# EasyEDA schematic SCH_5G23-dev1_2022-10-18.json

## Sheets
1 5G23: TITLE: 5G23; REV: 1.0; Date: 2022-04-18; Sheet: 1/1; Drawn By: BH2VGM; Company: NEU-ISE
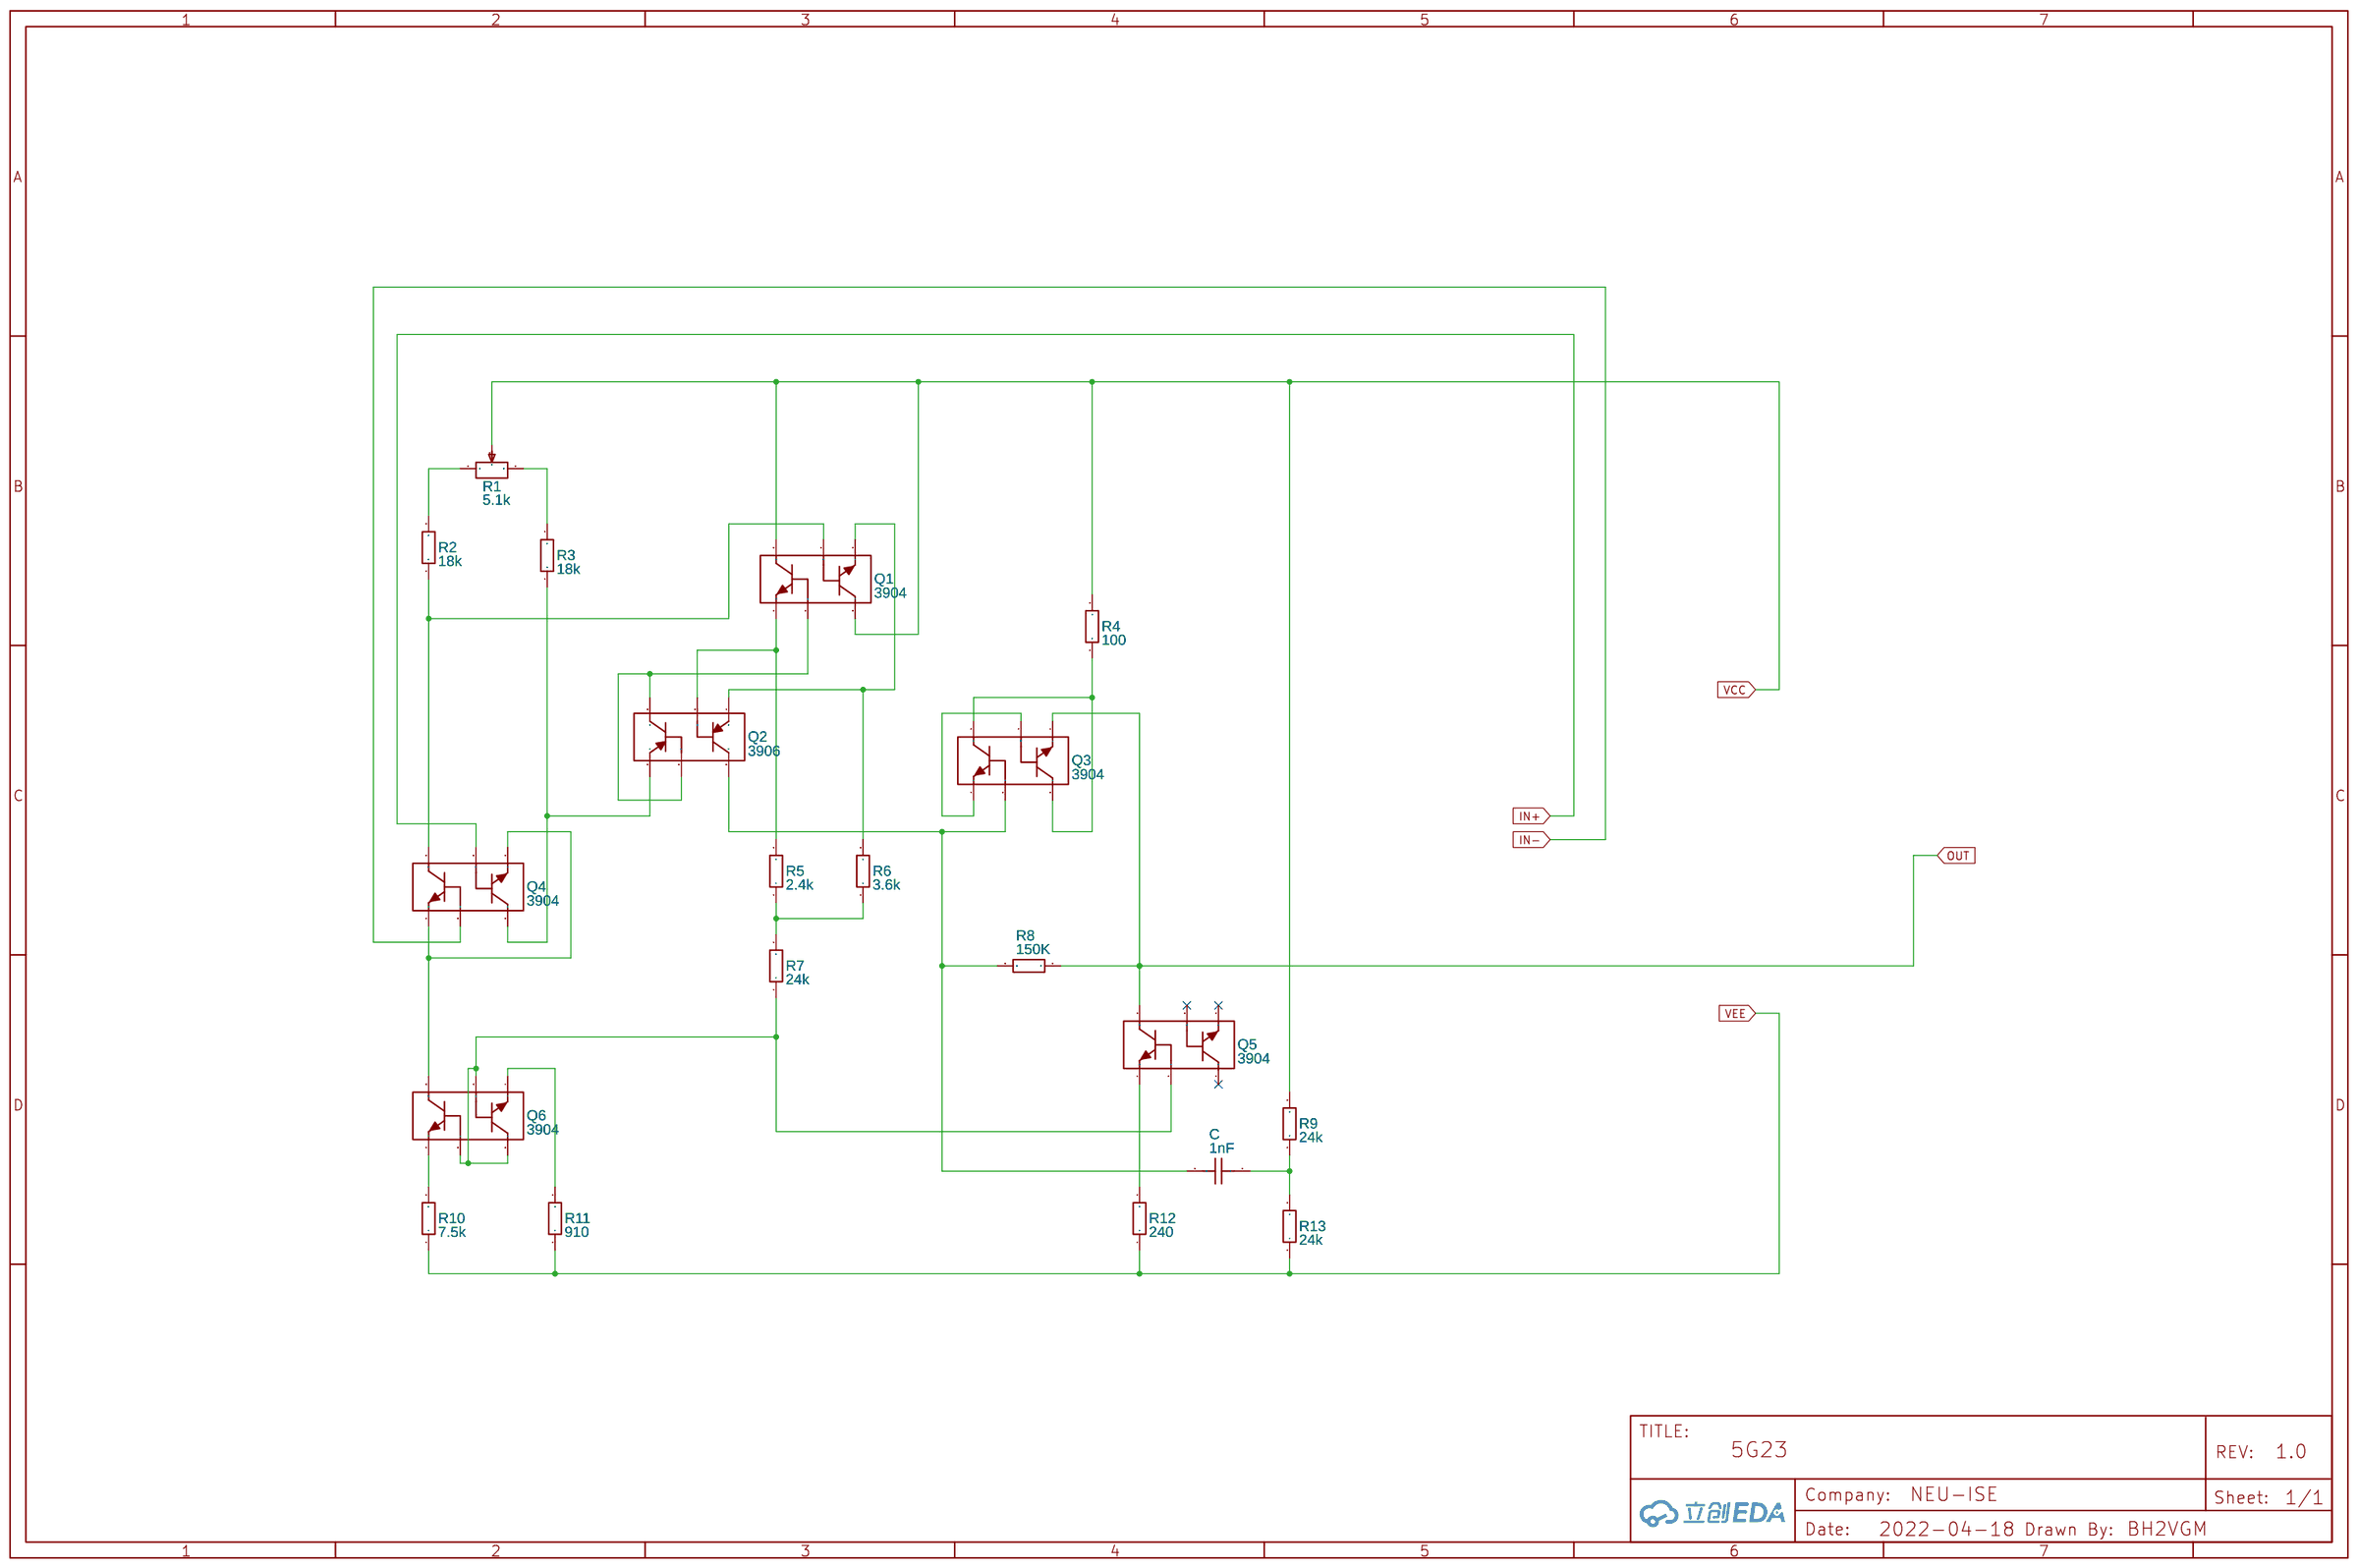
[diagram p0: 5G23]
2 CONN: TITLE: Sheet_1; Date: 2022-10-17; Drawn By: Denjhang; Company: Your Company
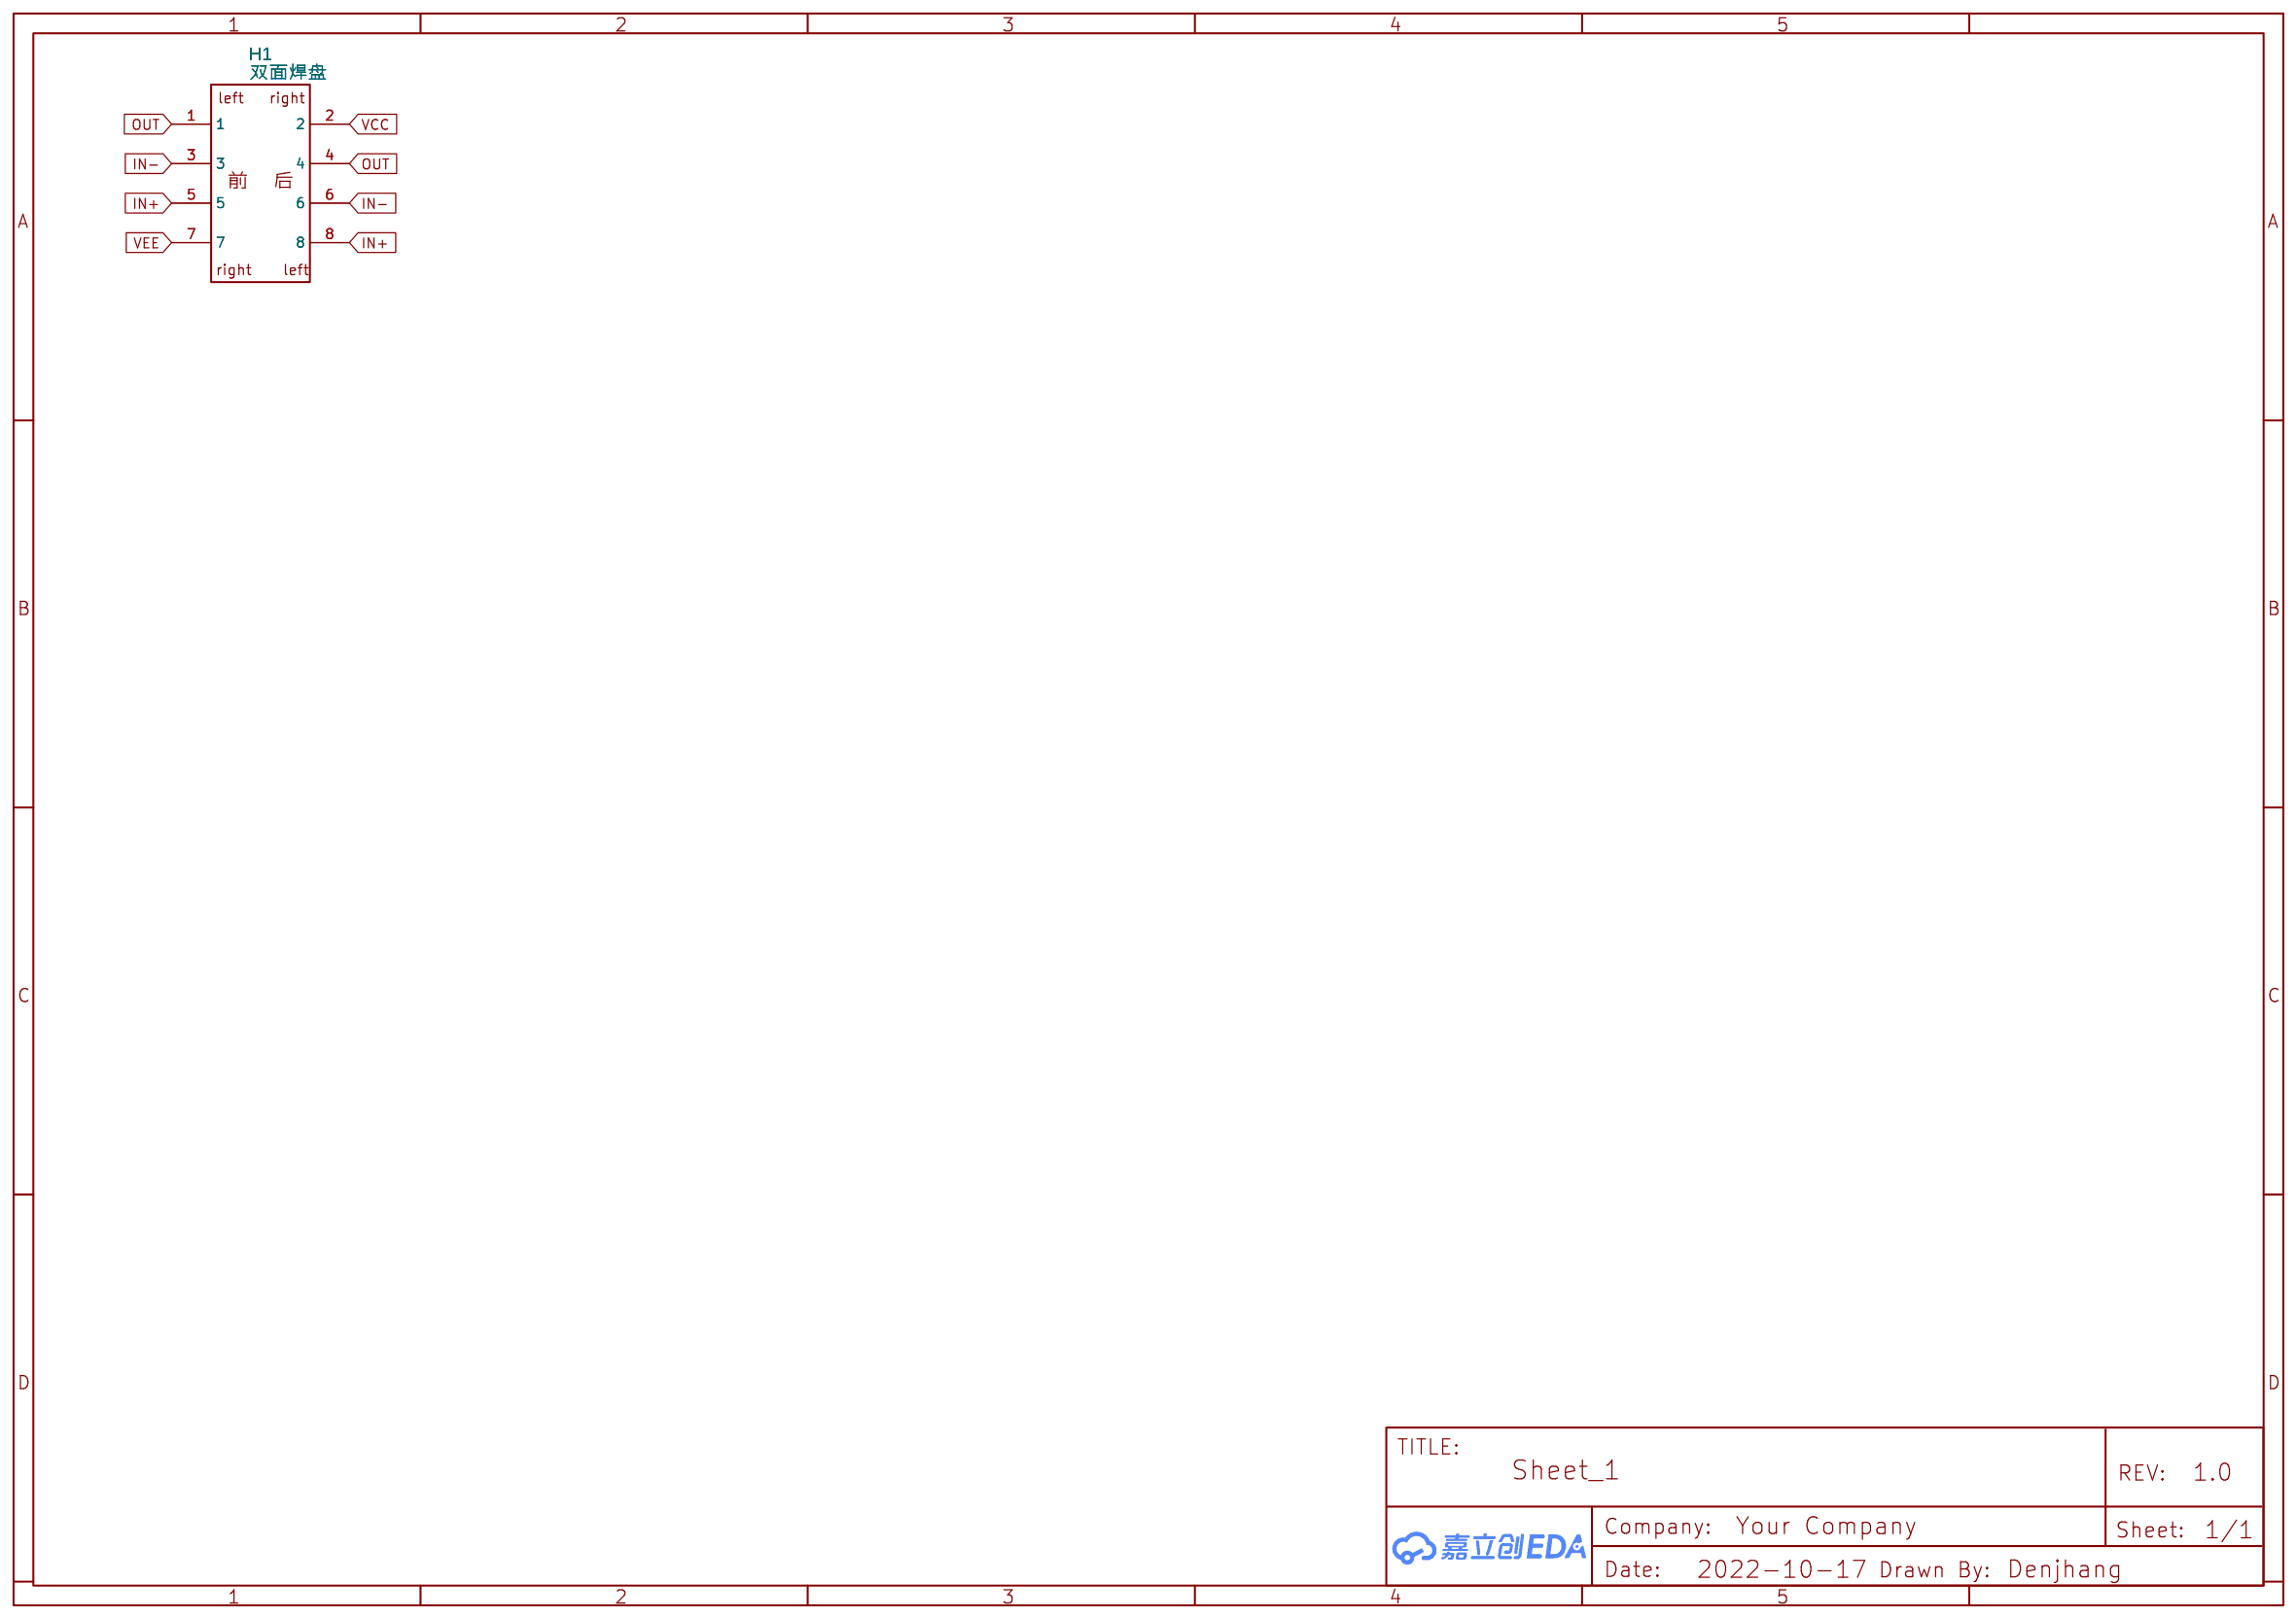
[diagram p1: CONN]

## Parts
sheet 5G23
C  1nF  [C0603]
Q1  3904  [SOT-363]
Q2  3906  [SOT-363]
Q3  3904  [SOT-363]
Q4  3904  [SOT-363]
Q5  3904  [SOT-363]
Q6  3904  [SOT-363]
R1  5.1k  [RES-ADJ-SMD_VG039NCH]
R2  18k  [R0603]
R3  18k  [R0603]
R4  100  [R0603]
R5  2.4k  [R0603]
R6  3.6k  [R0603]
R7  24k  [R0603]
R8  150K  [R0603]
R9  24k  [R0603]
R10  7.5k  [R0603]
R11  910  [R0603]
R12  240  [R0603]
R13  24k  [R0603]
sheet CONN
H1  双面焊盘  [DOUBLEFACE]

## Library data of the parts
C = 1NF-C0603: Supplier: LCSC; Supplier Part: C2940049; Manufacturer: null; Manufacturer Part: 1nF-C0603; Contributor: LCSC; JLCPCB Part Class: Extended Part
Q1 Q3-Q6 = MMDT3904: Supplier: LCSC; Manufacturer: DIODES; Manufacturer Part: MMDT3904-7-F; Supplier Part: C83572; JLCPCB Part Class: Extended Part; Contributor: king13478509115
Q2 = MMDT3906: Supplier: LCSC; Supplier Part: C779248; Manufacturer: MCC(Micro Commercial Components); Manufacturer Part: MMDT3906-TP; Contributor: king13478509115; JLCPCB Part Class: Extended Part
R1 = VG039NCHXTB204: Supplier: LCSC; Manufacturer: HDK; Supplier Part: C128551; Resistance(Ohms): 200K; Resistance (Ohms): 200K; JLCPCB Part Class: Extended Part
R2-R13 = 0805: Supplier: LCSC; Supplier Part: C9900012715; Manufacturer: null; link: https://atta.szlcsc.comnull; Contributor: LCSC; JLCPCB Part Class: Extended Part
H1 = 双面焊盘: Contributor: king13478509115

## Nets
VCC: H1.2 Q1.3(C) Q1.6(C) R1.2 R4.2 R9.2
VEE: H1.7 R10.1 R11.1 R12.1 R13.1
IN+: H1.5 H1.8 Q4.5(B)
IN-: H1.3 H1.6 Q4.2(B)
OUT: H1.1 H1.4 Q3.4(E) Q5.6(C) R8.1
Net-(C-1): C.1 Q2.3(C) Q3.2(B) R8.2
Net-(C-2): C.2 R9.1 R13.2
Net-(Q1-1): Q1.1(E) Q2.5(B) R5.2
Net-(Q1-2): Q1.2(B) Q2.2(B) Q2.6(C)
Net-(Q1-4): Q1.4(E) Q2.4(E) R6.2
Net-(Q1-5): Q1.5(B) Q4.6(C) R2.1
Net-(Q2-1): Q2.1(E) Q4.3(C) R3.1
Net-(Q3-1): Q3.1(E) Q3.5(B)
Net-(Q3-3): Q3.3(C) Q3.6(C) R4.1
Net-(Q4-1): Q4.1(E) Q4.4(E) Q6.6(C)
Net-(Q5-1): Q5.1(E) R12.2
Net-(Q5-2): Q5.2(B) Q6.2(B) Q6.3(C) Q6.5(B) R7.1
Net-(Q6-1): Q6.1(E) R10.2
Net-(Q6-4): Q6.4(E) R11.2
Net-(R1-1): R1.1 R2.2
Net-(R1-3): R1.3 R3.2
Net-(R5-1): R5.1 R6.1 R7.2

Not connected (* = marked no-connect by the designer): Q5 3(C)* 4(E)* 5(B)*
